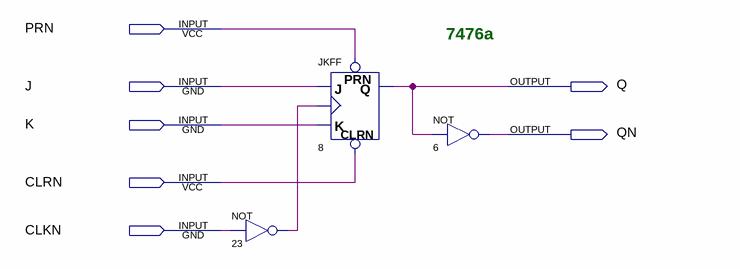
[diagram p0: schematic sheet]
// Quartus schematic JK_FF.bdf as structural Verilog: 3 symbols, 7 pins
module JK_FF (
  input  PRN,
  input  J,
  input  K,
  input  CLRN,
  input  CLKN,
  output Q,
  output QN
);

  wire n23_out;

  not u_23 (n23_out, CLKN);
  JKFF u_8 (.PRN(PRN), .CLRN(CLRN), .K(K), .J(J), .CLK(n23_out), .Q(Q));
  not u_6 (QN, Q);

  // Notes on the sheet:
  //   7476a
endmodule
